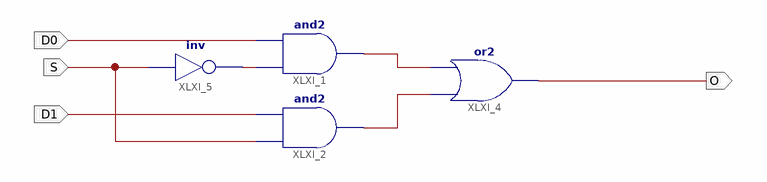
[diagram p0: schematic sheet 1]
// Xilinx ISE schematic my_2in_mux.sch (virtex6) as structural Verilog: 4 symbols, 4 ports
module my_2in_mux (
  input  S,
  input  D1,
  input  D0,
  output O
);

  wire XLXN_1, XLXN_2, XLXN_5;

  and XLXI_1 (XLXN_1, XLXN_5, D0);
  and XLXI_2 (XLXN_2, S, D1);
  or XLXI_4 (O, XLXN_2, XLXN_1);
  not XLXI_5 (XLXN_5, S);
endmodule
